# EAGLE design motor-control-board (EAGLE 7.2.0)
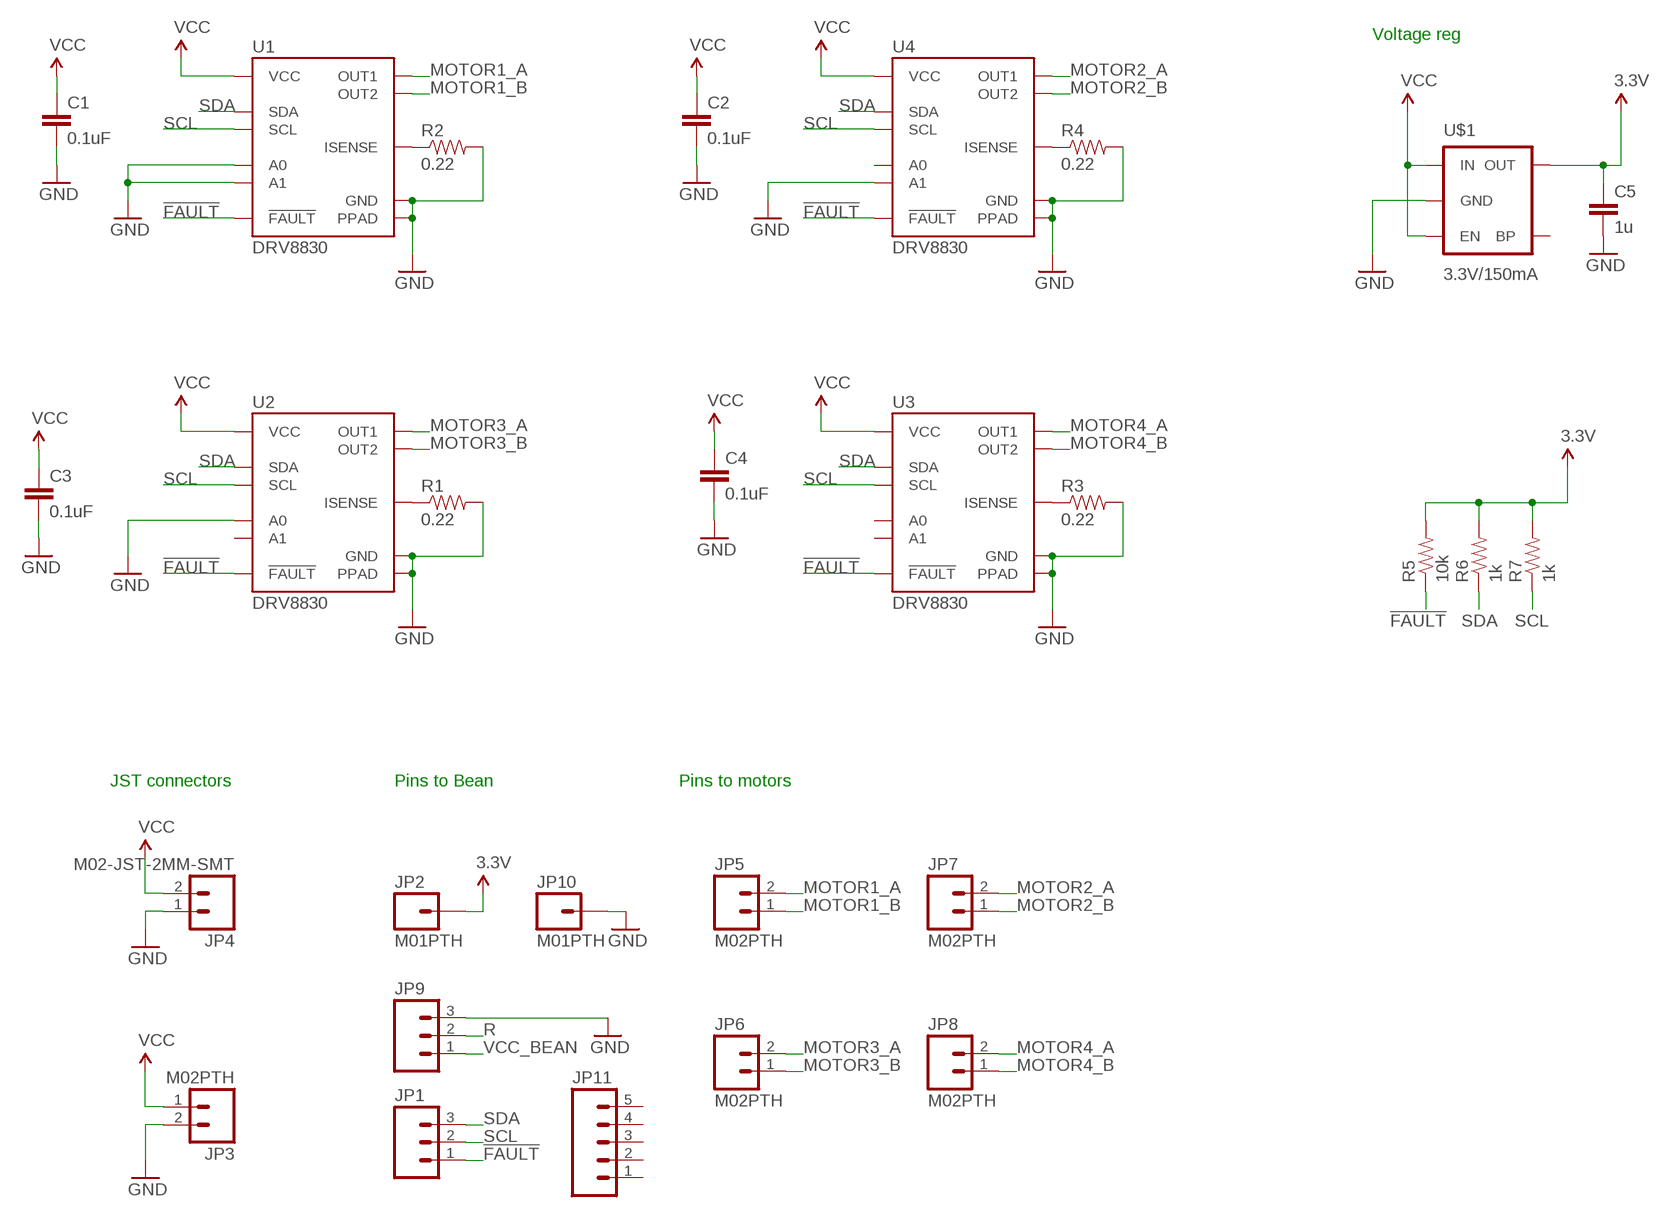
[diagram p0: schematic, sheet 1]

## Parts
C1  0.1uF  0.1UF-16V(+-10%)(0402)  [0402-CAP]
C2  0.1uF  0.1UF-16V(+-10%)(0402)  [0402-CAP]
C3  0.1uF  0.1UF-16V(+-10%)(0402)  [0402-CAP]
C4  0.1uF  CAP0402-CAP  [0402-CAP]
C5  1u  CAP0402-CAP  [0402-CAP]
JP1  M03PTH  [1X03]
JP2  M01PTH  [1X01]
JP3  M02PTH  [1X02]
JP4  M02-JST-2MM-SMT  [JST-2-SMD]
JP5  M02PTH  [1X02]
JP6  M02PTH  [1X02]
JP7  M02PTH  [1X02]
JP8  M02PTH  [1X02]
JP9  M03PTH  [1X03]
JP10  M01PTH  [1X01]
JP11  M05PTH  [1X05]
R1  0.22  RESISTOR0805-RES  [0805]
R2  0.22  RESISTOR0805-RES  [0805]
R3  0.22  RESISTOR0805-RES  [0805]
R4  0.22  RESISTOR0805-RES  [0805]
R5  10k  RESISTOR0402  [0402-RES]
R6  1k  RESISTOR0402  [0402-RES]
R7  1k  RESISTOR0402  [0402-RES]
U1  DRV8830  [MSOP-10-GNDPAD]
U2  DRV8830  [MSOP-10-GNDPAD]
U3  DRV8830  [MSOP-10-GNDPAD]
U4  DRV8830  [MSOP-10-GNDPAD]
U$1  3.3V/150mA  V_REG_MIC52053.3V  [SOT23-5]

## Nets
3.3V: C5.1 JP2.1 R5.2 R6.2 R7.2 U$1.5(OUT)
!FAULT: JP1.1 R5.1 U1.6(!FAULT) U2.6(!FAULT) U3.6(!FAULT) U4.6(!FAULT)
GND: C1.2 C2.2 C3.2 C4.2 C5.2 JP3.2 JP4.1 JP9.3 JP10.1 R1.2 R2.2 R3.2 R4.2 U1.5(GND) U1.7(A0) U1.8(A1) U1.GND(PPAD) U2.5(GND) U2.7(A0) U2.GND(PPAD) U3.5(GND) U3.GND(PPAD) U4.5(GND) U4.8(A1) U4.GND(PPAD) U$1.2(GND)
MOTOR1_A: JP5.2 U1.3(OUT1)
MOTOR1_B: JP5.1 U1.1(OUT2)
MOTOR2_A: JP7.2 U4.3(OUT1)
MOTOR2_B: JP7.1 U4.1(OUT2)
MOTOR3_A: JP6.2 U2.3(OUT1)
MOTOR3_B: JP6.1 U2.1(OUT2)
MOTOR4_A: JP8.2 U3.3(OUT1)
MOTOR4_B: JP8.1 U3.1(OUT2)
N$2: R2.1 U1.2(ISENSE)
N$3: R3.1 U3.2(ISENSE)
N$4: R1.1 U2.2(ISENSE)
N$5: R4.1 U4.2(ISENSE)
R: JP9.2
SCL: JP1.2 R7.1 U1.10(SCL) U2.10(SCL) U3.10(SCL) U4.10(SCL)
SDA: JP1.3 R6.1 U1.9(SDA) U2.9(SDA) U3.9(SDA) U4.9(SDA)
VCC: C1.1 C2.1 C3.1 C4.1 JP3.1 JP4.2 U1.4(VCC) U2.4(VCC) U3.4(VCC) U4.4(VCC) U$1.1(IN) U$1.3(EN)
VCC_BEAN: JP9.1
Unconnected: JP11.1 JP11.2 JP11.3 JP11.4 JP11.5 U2.8(A1) U3.7(A0) U3.8(A1) U4.7(A0) U$1.4(BP)

## Notes on the sheet
- Voltage reg
- JST connectors | Pins to Bean | Pins to motors

## Library data of the parts
C1-C3 = SparkFun-Capacitors:0.1UF-16V(+-10%)(0402); PROD_ID: CAP-12416
C4 C5 = SparkFun-Capacitors:CAP: Capacitor Standard 0603 ceramic capacitor, and 0.1" leaded capacitor.
JP1 JP9 = SparkFun-Connectors:M03: Header 3 Standard 3-pin 0.1" header. Use with straight break away headers (SKU : PRT-00116), right angle break away headers (PRT-00553), swiss pins (PRT-00743), machine pins (PRT-00117), and female headers (PRT-00115). Molex polarized connector foot print use with SKU : PRT-08232 with associated crimp pins and housings.
JP2 JP10 = SparkFun-Connectors:M01: Header 1 Standard 1-pin 0.1" header. Use with straight break away headers (SKU : PRT-00116), right angle break away headers (PRT-00553), swiss pins (PRT-00743), machine pins (PRT-00117), and female headers (PRT-00115).
JP3 JP5-JP8 = SparkFun-Connectors:M02: Standard 2-pin 0.1" header. Use with - straight break away headers ( PRT-00116) - right angle break away headers (PRT-00553) - swiss pins (PRT-00743) - machine pins (PRT-00117) - female headers (PRT-00115) Molex polarized connector foot print use with: PRT-08233 with associated crimp pins and housings. 2.54_SCREWTERM for use with PRT-10571. 3.5mm Screw Terminal footprints for PRT-08084 5mm Screw Terminal footprints for use with PRT-08432
JP4 = SparkFun-Connectors:M02: Standard 2-pin 0.1" header. Use with - straight break away headers ( PRT-00116) - right angle break away headers (PRT-00553) - swiss pins (PRT-00743) - machine pins (PRT-00117) - female headers (PRT-00115) Molex polarized connector foot print use with: PRT-08233 with associated crimp pins and housings. 2.54_SCREWTERM for use with PRT-10571. 3.5mm Screw Terminal footprints for PRT-08084 5mm Screw Terminal footprints for use with PRT-08432; PROD_ID: CONN-08352
JP11 = SparkFun-Connectors:M05: Header 5 Standard 5-pin 0.1" header. Use with straight break away headers (SKU : PRT-00116), right angle break away headers (PRT-00553), swiss pins (PRT-00743), machine pins (PRT-00117), and female headers (PRT-00115). Molex polarized connector foot print use with SKU : PRT-08230 with associated crimp pins and housings.
R1-R7 = SparkFun-Resistors:RESISTOR: Resistor Basic schematic elements and footprints for 0603, 1206, and PTH resistors.
U1-U4 = SparkFun-PowerIC:DRV8830: DRV8830 I2C DC Motor Driver TSSOP-10 with exposed power pad 1A current limit, 2.75V to 6.8V; PROD_ID: IC-11646
U$1 = SparkFun-PowerIC:V_REG_MIC5205: V_REG MIC5219 Standard 3.3V and 5V 150mA LDO voltage regulator in SOT-23 layout. Micrel part MIC5205. BP (by-pass) pin is used to lower output noise with 470pF cap, may be left open.; PROD_ID: VREG-00822

## Board
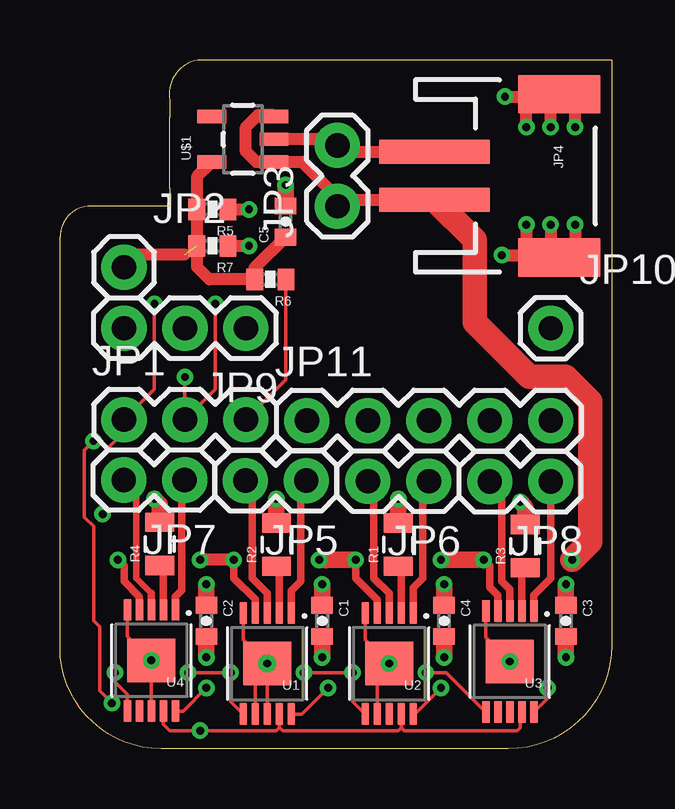
[diagram p1: board, top side]
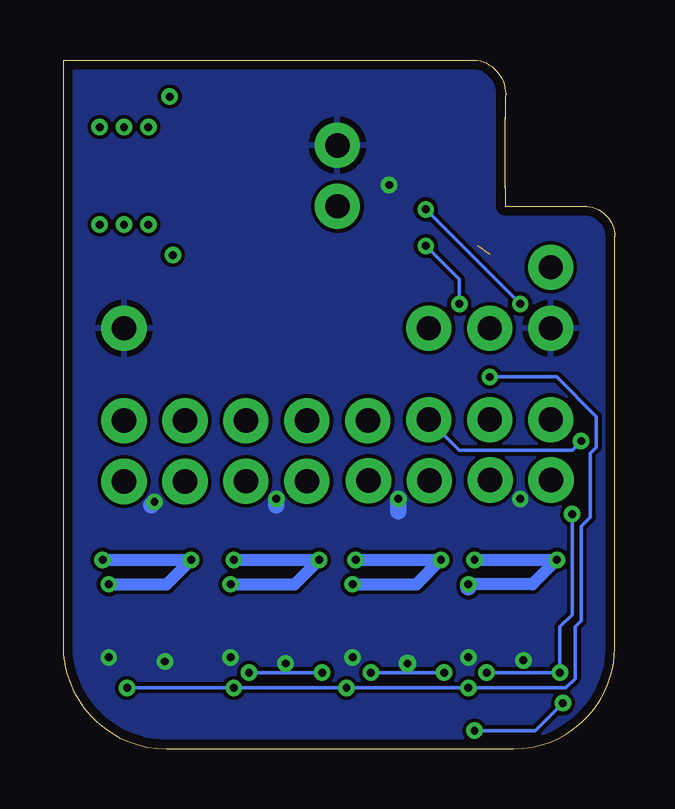
[diagram p2: board, bottom side, seen from below]

Size 22.99 x 28.7 mm. Coordinates in mm from the lower left corner, seen from the top.
Outline: 4.57,23.37 4.57,26.32
Outline: 4.57,26.29 4.57,27.02 arc-90 5.74,28.7 22.99,28.7 22.99,4.31 arc-90 18.68,0 4.22,0 arc-90 0,4.22 0,21.34 arc-90 1.27,22.61 4.57,22.61
Outline: 4.57,23.37 4.57,22.61
Copper layers (1*16): Top 0.0356mm / dielectric 1.5011mm / Bottom 0.0356mm
Design rules "OSH-park": minimum track width 6mil, minimum drill 13mil, track to track 6mil, track to pad 6mil, pad to pad 6mil, via to via 6mil, smd to smd 6mil, copper to edge 15mil, drill to drill 6mil, minimum pad ring 7mil, minimum via ring 7mil, stop-mask expansion 3mil, vias tented up to drill 0mil, thermal gap 10mil

### Footprints (pad centres in the part's own frame; a part is rotated, then mirrored left to right if it is on the bottom)
0402-CAP = smd 0.7 x 0.9: 1 -0.65,0; 2 0.65,0
1X03 = drill 1.016 pad 1.88: 1 0,0; 2 2.54,0; 3 5.08,0
1X01 = drill 1.016 pad 1.88: 1 0,0
1X02 = drill 1.016 pad 1.88: 1 0,0; 2 2.54,0
JST-2-SMD = smd 1 x 4.6: 1 -1,-3.7; 2 1,-3.7 | smd 1.6 x 3.4: NC1 -3.4,1.5; NC2 3.4,1.5
1X05 = drill 1.016 pad 1.88: 1 0,0; 2 2.54,0; 3 5.08,0; 4 7.62,0; 5 10.16,0
0805 = smd 0.8 x 1.2: 1 -0.9,0; 2 0.9,0
0402-RES = smd 0.7 x 0.9: 1 -0.65,0; 2 0.65,0
MSOP-10-GNDPAD = smd 0.305 x 0.889: 1 -1,-2.11; 2 -0.5,-2.11; 3 0,-2.11; 4 0.5,-2.11; 5 1,-2.11; 6 1,2.11; 7 0.5,2.11; 8 0,2.11; 9 -0.5,2.11; 10 -1,2.11 | smd 2 x 1.8: GND 0,0
SOT23-5 = smd 0.55 x 1.2: 1 -0.95,-1.3; 2 0,-1.3; 3 0.95,-1.3; 4 0.95,1.3; 5 -0.95,1.3

### Placement (x,y rotation side)
C1  10.92,5.33 270 top
C2  6.1,5.33 270 top
C3  21.08,5.33 270 top
C4  16,5.33 270 top
C5  9.4,21.97 90 top
JP1  2.67,13.72 0 top
JP2  2.67,20.07 0 top
JP3  11.56,22.61 90 top
JP4  19.3,23.88 270 top
JP5  10.26,11.18 180 top
JP6  15.37,11.15 180 top
JP7  5.19,11.2 180 top
JP8  20.45,11.14 180 top
JP9  7.75,17.53 180 top
JP10  20.45,17.53 0 top
JP11  10.29,13.68 0 top
R1  14.1,8.51 90 top
R2  9.02,8.51 90 top
R3  19.39,8.44 90 top
R4  4.16,8.54 90 top
R5  6.35,22.48 180 top
R6  8.76,19.56 180 top
R7  6.35,20.95 180 top
U1  8.64,3.56 180 top
U2  13.72,3.56 180 top
U3  18.74,3.64 180 top
U4  3.81,3.68 180 top
U$1  7.62,25.4 90 top

### Tracks (layer width: path | path; a pad name or v marks a point on that pad's centre or on a via)
3.3V  (1 unrouted)
  Top 0.508: 5.68,22.49 R5.2 | 8.11,19.78 R6.2 | C5.1 8.11,20.04 R6.2 | R6.2 6.22,19.56 5.7,20.08 R7.2 R5.2 | 5.19,20.59 3.19,20.59 JP2.1 | U$1.5 5.7,23.83 R5.2
!FAULT  (via drill 0.33, 0.33 pad 0.69)
  Top 0.152: v3.94,18.54 3.94,14.99 JP1.1 2.67,13.21 1.4,11.94 1.4,10.54 1.78,10.16 v1.78,9.78 | v5.33,3.17 v7.11,3.17 7.11,1.97 U1.6 | v10.16,3.17 v12.19,3.17 12.19,1.97 U2.6 | U4.6 2.81,2.27 2.29,2.79 v2.29,3.17 | v15.24,3.17 16.1,3.17 U3.6
  Top 0.508: R5.1 v7.87,22.48
  Bottom 0.152: v7.11,3.17 v10.16,3.17 | v12.19,3.17 v15.24,3.17 | v1.78,9.78 1.78,5.59 2.29,5.08 v2.29,3.17 v5.33,3.17 | v7.87,22.48 v3.94,18.54
GND  (via drill 0.33, 0.33 pad 0.69, 0.33 pad 0.74)
  Top 0.152: U3.GND 17.74,4.64 U3.5 | U2.5 12.72,4.56 U2.GND 13.22,3.06 U2.7 | U1.5 7.64,4.56 U1.GND | U4.5 2.81,4.68 U4.GND U4.8 | U1.7 8.14,3.06 U1.GND | U1.8 U1.GND
  Top 0.508: U$1.2 11.3,25.4 JP3.2 11.83,24.88 JP4.1
  Top 0.686: v16,3.81 C4.2 | C1.2 v10.92,3.81 | C3.2 v21.08,3.81 | C5.2 v9.4,23.5 | C2.2 v6.1,3.81 | R2.2 v9.02,10.41 | R1.2 v14.1,10.41 | v19.18,10.29 19.39,10.07 R3.2 | R4.2 4.16,10.19 v3.94,10.41
  Bottom 0.686: v14.1,10.41 14.1,10.16 | v9.02,10.41 9.02,9.91 | v19.18,10.29 19.3,10.16
  other vias: 13.72,3.56 8.64,3.56 18.74,3.64 3.81,3.68
  pour Bottom: 3.94,28.96 24.51,28.7 24.51,-3.81 -1.65,-4.06 -1.65,23.62 3.94,23.62
MOTOR1_A
  Top 0.305: JP5.2 8,10.9 8,7.11 8.64,6.48 U1.3
MOTOR1_B
  Top 0.305: JP5.1 10.03,10.95 10.03,6.99 9.64,6.59 U1.1
MOTOR2_A
  Top 0.279: 3.17,10.68 3.17,7.11 3.81,6.48
  Top 0.305: JP7.2 3.17,10.68 | 3.81,6.48 U4.3
MOTOR2_B
  Top 0.305: JP7.1 5.08,11.09 5.08,6.6 4.81,6.33 U4.1
MOTOR3_A
  Top 0.305: JP6.2 13.08,10.9 13.08,7.11 13.72,6.48 U2.3
MOTOR3_B
  Top 0.305: JP6.1 15.11,10.9 15.11,7.11 14.72,6.71 U2.1
MOTOR4_A
  Top 0.305: JP8.2 18.41,10.63 18.41,6.99 18.74,6.66 U3.3
MOTOR4_B
  Top 0.305: JP8.1 20.45,7.11 19.74,6.41 U3.1
N$2
  Top 0.305: R2.1 9.02,7.37 9.14,7.24 U1.2
N$3
  Top 0.305: R3.1 19.24,7.4 U3.2
N$4
  Top 0.305: R1.1 14.22,7.61 U2.2
N$5
  Top 0.305: R4.1 4.31,7.49 U4.2
N$6  (via drill 0.33)
  other vias: 18.54,27.18
N$7  (via drill 0.33)
  Top 0.508: v19.43,25.91 19.43,26.67
N$8  (via drill 0.33)
  Top 0.508: v20.45,25.91 20.45,26.67
N$9  (via drill 0.33)
  Top 0.508: v21.46,25.91 21.46,26.67
N$10
  Top 0.508: 18.67,27.18 19.43,27.18
N$11  (via drill 0.33)
  Top 0.508: v21.46,21.84 21.46,21.08
N$12  (via drill 0.33)
  Top 0.508: v20.45,21.84 20.45,21.08
N$13  (via drill 0.33)
  Top 0.508: v19.43,21.84 19.43,21.08
N$14  (via drill 0.33)
  Top 0.508: v18.41,20.57 19.43,20.57
SCL  (via drill 0.33, 0.33 pad 0.69)
  Top 0.152: v6.48,18.54 6.48,14.99 JP1.2 v5.21,15.49 | 9.71,1.52 U1.10 10.08,1.45 v11.18,2.54 | v6.1,2.54 5.13,1.57 U4.10 | v15.88,2.54 14.78,1.45 U2.10 | v20.32,2.54 20.32,2.11 U3.10
  Top 0.508: R7.1 v7.87,20.95
  Bottom 0.152: v5.21,15.49 2.41,15.49 0.76,13.84 0.76,12.57 1.02,12.32 1.02,9.65 1.4,9.27 1.4,5.33 1.65,5.08 1.65,2.92 2.03,2.54 v6.1,2.54 v11.18,2.54 v15.88,2.54 v20.32,2.54 | v7.87,20.95 6.48,19.56 v6.48,18.54
SDA  (via drill 0.33 pad 0.69)
  Top 0.152: R6.1 9.41,15.38 JP1.3 | 14.22,1.44 U2.9 | 19.3,1.47 U3.9 19.18,1.46 19.18,0.89 19.05,0.76 14.35,0.76 14.22,0.9 U2.9 | 9.14,1.02 U1.9 | v1.4,12.83 1.02,12.45 1.02,9.65 1.4,9.27 1.4,5.33 1.65,5.08 1.65,2.41 v2.16,1.91 | U4.9 4.31,1.02 4.57,0.76 v5.84,0.76 9.02,0.76 9.14,0.89 9.14,1.44 U1.9 | U1.9 9.14,0.9 9.27,0.76 14.1,0.76 14.22,0.88 U2.9
  Bottom 0.152: JP1.3 6.48,12.45 1.78,12.45 v1.4,12.83 | v2.16,1.91 3.3,0.76 v5.84,0.76
VCC  (via drill 0.33 pad 0.69)
  Top 0.305: U1.4 8.13,5.67 8.13,6.22 7.24,7.11 v7.24,7.87 | U4.4 3.31,6.34 2.67,6.99 2.67,7.62 v2.41,7.87 | v12.32,7.87 12.32,7.11 13.22,6.21 U2.4 | v17.65,7.87 17.91,7.62 17.91,6.73 18.24,6.39 U3.4
  Top 0.508: JP3.1 11.68,22.61 | v7.24,7.87 v5.84,7.87 | JP3.1 11.83,22.88 JP4.2 | U$1.3 8.85,26.42 8.26,26.42 7.75,25.91 7.75,24.89 8.19,24.45 U$1.1 10.09,24.45 11.56,22.99 JP3.1 | 15.62,22.86 JP4.2 | JP4.2
  Top 0.686: v15.88,7.87 v17.65,7.87 | v12.32,7.87 v10.79,7.87 11.06,7.86 | C2.1 v6.1,6.86 | C3.1 v21.08,6.86 | C4.1 v16,6.86 | C1.1 v10.92,6.86
  Top 1.016: JP4.2 17.27,21.21 17.27,17.78 19.56,15.49 21.08,15.49 22.1,14.48 22.1,8.64 v21.34,7.87
  Bottom 0.508: v21.34,7.87 v17.65,7.87 18.67,6.86 v21.08,6.86 | v15.88,7.87 v12.32,7.87 13.34,6.86 v16,6.86 | v10.79,7.87 v7.24,7.87 8.26,6.86 v10.92,6.86 | v5.84,7.87 v2.41,7.87 3.43,6.86 v6.1,6.86
  Bottom 0.686: v6.1,6.86 6.1,6.73

### Text on the board
Reference: BAT | G / N / D | R | V / C / C | G / N / D | A0 | A1 | 0 | 1 | 2 | 3 | 4 | 5 | 1A | 1B | 2A | 2B | 3A | 3B | 4A | 4B
bArt: - | BAT | + | G / N / D | R | V / C / C | G / N / D | A0 | A1 | 0 | 1 | 2 | 3 | 4 | 5 | MOTOR 1 | MOTOR 2 | MOTOR 3 | MOTOR 4 | LightBlue Bean / H-bridge / motor controller